# Altium schematic sheet SCH_HVKQ_Mr_THANG.SchDoc
size A2; SheetNumber: 1; SheetTotal: 1
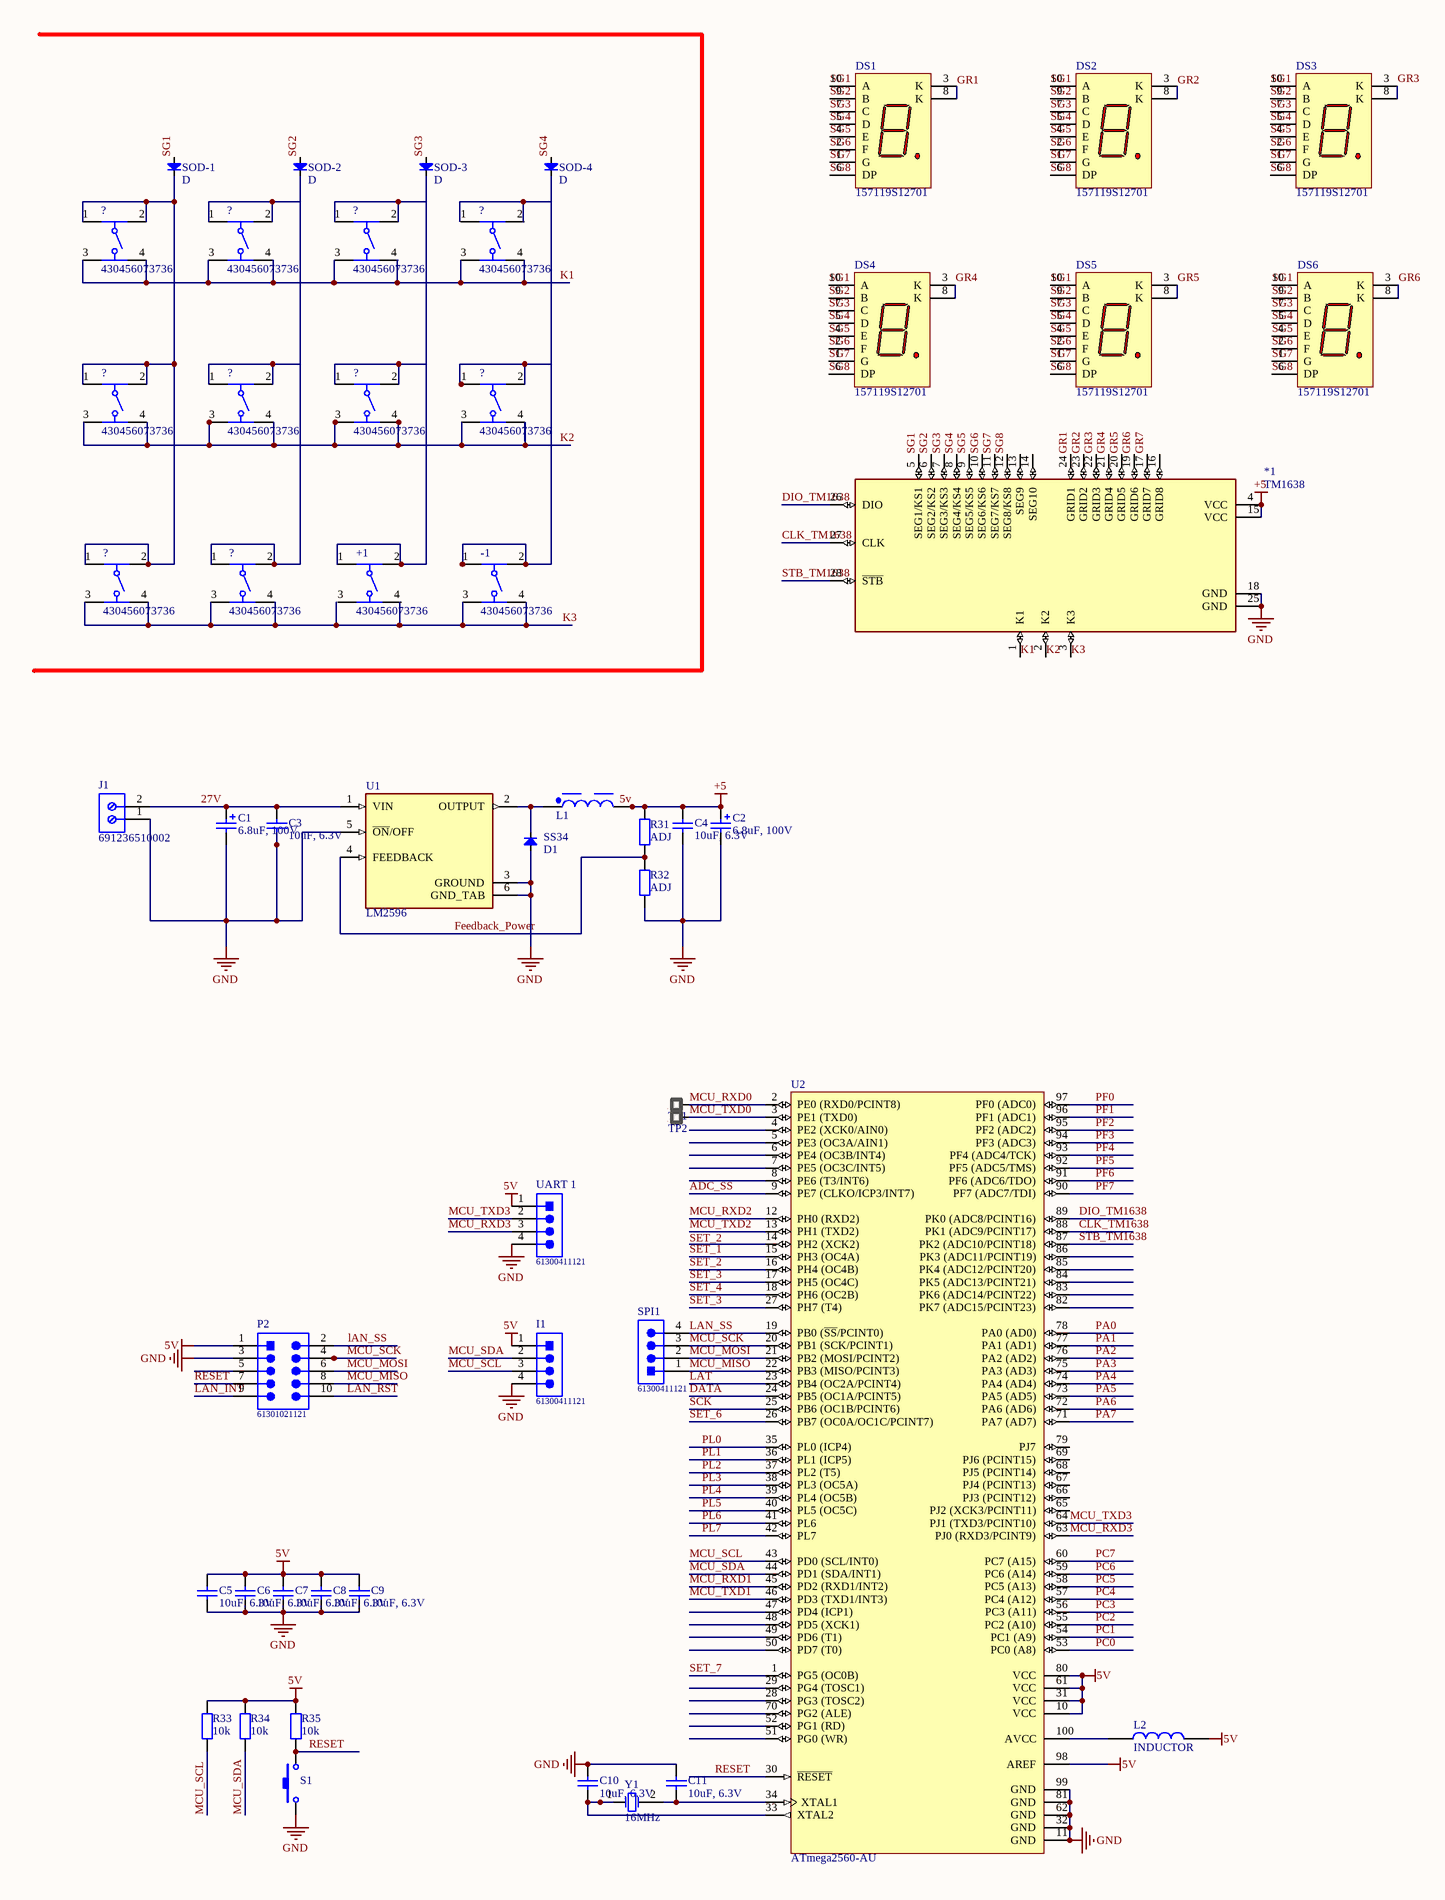
[diagram p0: SCH_HVKQ_Mr_THANG.SchDoc, left]
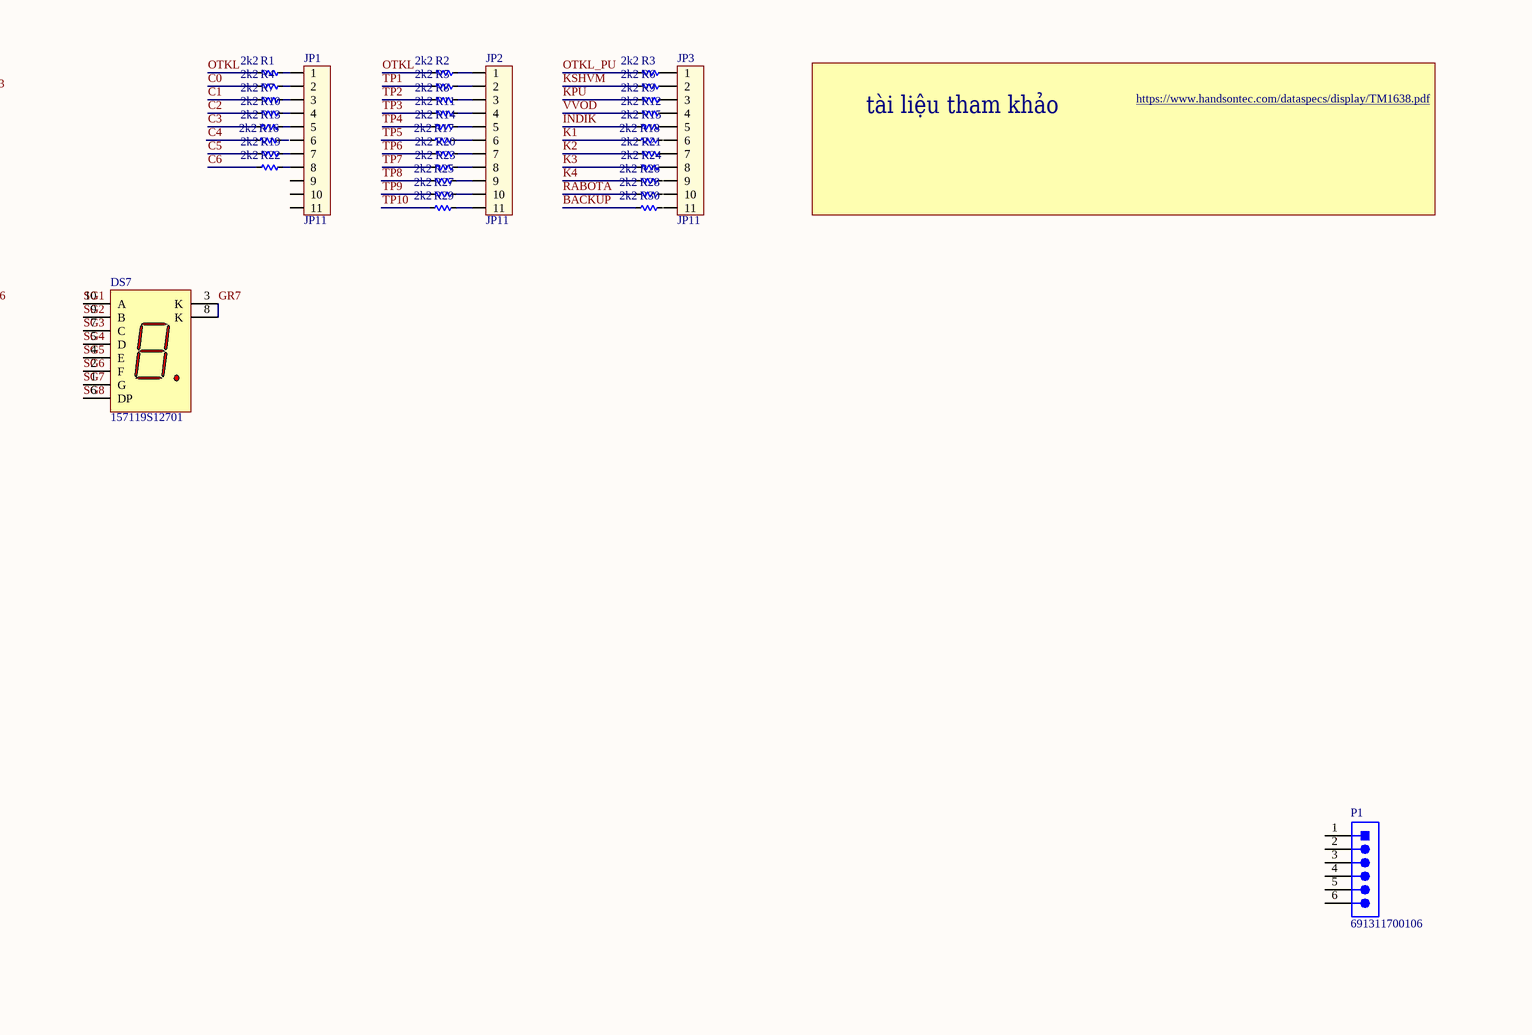
[diagram p1: SCH_HVKQ_Mr_THANG.SchDoc, right]

## Parts
(Parts that share a designator on the sheet are numbered #1, #2 ... from top to bottom, then left to right.)
*1  TM1638  [SOIC28]
+1  430456073736  [4304x60737x6]
-1  430456073736  [4304x60737x6]
?#1  430456073736  [4304x60737x6]
?#2  430456073736  [4304x60737x6]
?#3  430456073736  [4304x60737x6]
?#4  430456073736  [4304x60737x6]
?#5  430456073736  [4304x60737x6]
?#6  430456073736  [4304x60737x6]
?#7  430456073736  [4304x60737x6]
?#8  430456073736  [4304x60737x6]
?#9  430456073736  [4304x60737x6]
?#10  430456073736  [4304x60737x6]
C1  6.8uF, 100V  [WCAP-PSHP_D8H8.7]
C2  6.8uF, 100V  [WCAP-PSHP_D8H8.7]
C3  10uF, 6.3V  [WCAP-CSGP_0805_L2W1.25H1.25]
C4  10uF, 6.3V  [WCAP-CSGP_0805_L2W1.25H1.25]
C5  10uF, 6.3V  [WCAP-CSGP_0805_L2W1.25H1.25]
C6  10uF, 6.3V  [WCAP-CSGP_0805_L2W1.25H1.25]
C7  10uF, 6.3V  [WCAP-CSGP_0805_L2W1.25H1.25]
C8  10uF, 6.3V  [WCAP-CSGP_0805_L2W1.25H1.25]
C9  10uF, 6.3V  [WCAP-CSGP_0805_L2W1.25H1.25]
C10  10uF, 6.3V  [WCAP-CSGP_0805_L2W1.25H1.25]
C11  10uF, 6.3V  [WCAP-CSGP_0805_L2W1.25H1.25]
D1  SS34  [DIO-SMD-106]
DS1  157119S12701  [WL-T7DS_L13W10H7]
DS2  157119S12701  [WL-T7DS_L13W10H7]
DS3  157119S12701  [WL-T7DS_L13W10H7]
DS4  157119S12701  [WL-T7DS_L13W10H7]
DS5  157119S12701  [WL-T7DS_L13W10H7]
DS6  157119S12701  [WL-T7DS_L13W10H7]
DS7  157119S12701  [WL-T7DS_L13W10H7]
I1  61300411121  [61300411121]
J1  691236510002  [691236510002]
JP1  JP11  [Header11]
JP2  JP11  [Header11]
JP3  JP11  [Header11]
L1  470µH, 0.97A  [WE-PD HV_1210]  (value not drawn)
L2  INDUCTOR  [L_0805]
P1  691311700106  [691311700106]
P2  61301021121  [61301021121]
R1  2k2  [RES-SMD-1206]
R2  2k2  [RES-SMD-1206]
R3  2k2  [RES-SMD-1206]
R4  2k2  [RES-SMD-1206]
R5  2k2  [RES-SMD-1206]
R6  2k2  [RES-SMD-1206]
R7  2k2  [RES-SMD-1206]
R8  2k2  [RES-SMD-1206]
R9  2k2  [RES-SMD-1206]
R10  2k2  [RES-SMD-1206]
R11  2k2  [RES-SMD-1206]
R12  2k2  [RES-SMD-1206]
R13  2k2  [RES-SMD-1206]
R14  2k2  [RES-SMD-1206]
R15  2k2  [RES-SMD-1206]
R16  2k2  [RES-SMD-1206]
R17  2k2  [RES-SMD-1206]
R18  2k2  [RES-SMD-1206]
R19  2k2  [RES-SMD-1206]
R20  2k2  [RES-SMD-1206]
R21  2k2  [RES-SMD-1206]
R22  2k2  [RES-SMD-1206]
R23  2k2  [RES-SMD-1206]
R24  2k2  [RES-SMD-1206]
R25  2k2  [RES-SMD-1206]
R26  2k2  [RES-SMD-1206]
R27  2k2  [RES-SMD-1206]
R28  2k2  [RES-SMD-1206]
R29  2k2  [RES-SMD-1206]
R30  2k2  [RES-SMD-1206]
R31  ADJ  [WRIS-PSMB_0805_H0.35]
R32  ADJ  [WRIS-PSMB_0805_H0.35]
R33  10k  [WRIS-PSMB_0805_H0.35]
R34  10k  [WRIS-PSMB_0805_H0.35]
R35  10k  [WRIS-PSMB_0805_H0.35]
S1  SW-SMD  [SW-SMD]  (value not drawn)
SOD-1  D  [SOD-80]
SOD-2  D  [SOD-80]
SOD-3  D  [SOD-80]
SOD-4  D  [SOD-80]
SPI1  61300411121  [61300411121]
TP1  TP  [TP]  (value not drawn)
TP2  TP  [TP]  (value not drawn)
U1  LM2596  [LM2596]
U2  ATmega2560-AU  [TQFP100L]
UART_1  61300411121  [61300411121]
Y1  16MHz  [WE-XTAL_HC49/4HSMX]

## Nets
5v: *1.4(VCC) *1.15(VCC) C2.1(P) C4.2 C5.2 C6.2 C7.2 C8.2 C9.2 I1.1 L1.2 L2.2 P2.1 R31.2 R33.2 R34.2 R35.2 U2.10(VCC) U2.31(VCC) U2.61(VCC) U2.80(VCC) U2.98(AREF) UART_1.1  [also labelled +5]
GND: *1.18(GND) *1.25(GND) C1.2(N) C2.2(N) C3.1 C4.1 C5.1 C6.1 C7.1 C8.1 C9.1 C10.2 C11.2 D1.1(A) I1.4 J1.1 P2.3 R32.1 S1.1 U1.3(GROUND) U1.5(~{ON}/OFF) U1.6(GND_TAB) U2.11(GND) U2.32(GND) U2.62(GND) U2.81(GND) U2.99(GND) UART_1.4
27V: C1.1(P) C3.2 J1.2 U1.1(VIN)
ADC_SS: U2.9(PE7_(CLKO/ICP3/INT7))
BACKUP: R30.2
C0: R4.2
C1: R7.2
C2: R10.2
C3: R13.2
C4: R16.2
C5: R19.2
C6: R22.2
CLK_TM1638: *1.27(CLK) U2.88(PK1_(ADC9/PCINT17))
DATA: U2.24(PB5_(OC1A/PCINT5))
DIO_TM1638: *1.26(DIO) U2.89(PK0_(ADC8/PCINT16))
Feedback_Power: R31.1 R32.2 U1.4(FEEDBACK)
GR1: *1.24(GRID1) DS1.3(K) DS1.8(K)
GR2: *1.23(GRID2) DS2.3(K) DS2.8(K)
GR3: *1.22(GRID3) DS3.3(K) DS3.8(K)
GR4: *1.21(GRID4) DS4.3(K) DS4.8(K)
GR5: *1.20(GRID5) DS5.3(K) DS5.8(K)
GR6: *1.19(GRID6) DS6.3(K) DS6.8(K)
GR7: *1.17(GRID7) DS7.3(K) DS7.8(K)
INDIK: R15.2
K1: *1.1(K1) ?#1.3 ?#1.4 ?#2.3 ?#2.4 ?#3.3 ?#3.4 ?#4.3 ?#4.4 R18.2
K2: *1.2(K2) ?#5.3 ?#5.4 ?#6.3 ?#6.4 ?#7.3 ?#7.4 ?#8.3 ?#8.4 R21.2
K3: *1.3(K3) -1.3 -1.4 ?#9.3 ?#9.4 ?#10.3 ?#10.4 R24.2
K4: R26.2
KPU: R9.2
KSHVM: R6.2
LAN_INT: P2.9
LAN_RST: P2.10
LAN_SS: P2.2 SPI1.4 U2.19(PB0_(~{SS}/PCINT0))
LAT: U2.23(PB4_(OC2A/PCINT4))
MCU_MISO: P2.8 SPI1.1 U2.22(PB3_(MISO/PCINT3))
MCU_MOSI: P2.6 SPI1.2 U2.21(PB2_(MOSI/PCINT2))
MCU_RXD0: TP1.1 U2.2(PE0_(RXD0/PCINT8))
MCU_RXD1: U2.45(PD2_(RXD1/INT2))
MCU_RXD2: U2.12(PH0_(RXD2))
MCU_RXD3: U2.63(PJ0_(RXD3/PCINT9)) UART_1.3
MCU_SCK: P2.4 SPI1.3 U2.20(PB1_(SCK/PCINT1))
MCU_SCL: I1.3 R33.1 U2.43(PD0_(SCL/INT0))
MCU_SDA: I1.2 R34.1 U2.44(PD1_(SDA/INT1))
MCU_TXD0: TP2.1 U2.3(PE1_(TXD0))
MCU_TXD1: U2.46(PD3_(TXD1/INT3))
MCU_TXD2: U2.13(PH1_(TXD2))
MCU_TXD3: U2.64(PJ1_(TXD3/PCINT10)) UART_1.2
OTKL: R1.2 R2.2
OTKL_PU: R3.2
PA0: U2.78(PA0_(AD0))
PA1: U2.77(PA1_(AD1))
PA2: U2.76(PA2_(AD2))
PA3: U2.75(PA3_(AD3))
PA4: U2.74(PA4_(AD4))
PA5: U2.73(PA5_(AD5))
PA6: U2.72(PA6_(AD6))
PA7: U2.71(PA7_(AD7))
PC0: U2.53(PC0_(A8))
PC1: U2.54(PC1_(A9))
PC2: U2.55(PC2_(A10))
PC3: U2.56(PC3_(A11))
PC4: U2.57(PC4_(A12))
PC5: U2.58(PC5_(A13))
PC6: U2.59(PC6_(A14))
PC7: U2.60(PC7_(A15))
PF0: U2.97(PF0_(ADC0))
PF1: U2.96(PF1_(ADC1))
PF2: U2.95(PF2_(ADC2))
PF3: U2.94(PF3_(ADC3))
PF4: U2.93(PF4_(ADC4/TCK))
PF5: U2.92(PF5_(ADC5/TMS))
PF6: U2.91(PF6_(ADC6/TDO))
PF7: U2.90(PF7_(ADC7/TDI))
PL0: U2.35(PL0_(ICP4))
PL1: U2.36(PL1_(ICP5))
PL2: U2.37(PL2_(T5))
PL3: U2.38(PL3_(OC5A))
PL4: U2.39(PL4_(OC5B))
PL5: U2.40(PL5_(OC5C))
PL6: U2.41(PL6)
PL7: U2.42(PL7)
RABOTA: R28.2
RESET: P2.7 R35.1 S1.2 U2.30(~{RESET})
SCK: U2.25(PB6_(OC1B/PCINT6))
SET_1: U2.15(PH3_(OC4A))
SET_2: U2.16(PH4_(OC4B))
SET_3: U2.17(PH5_(OC4C)) U2.27(PH7_(T4))
SET_4: U2.18(PH6_(OC2B))
SET_6: U2.26(PB7_(OC0A/OC1C/PCINT7))
SET_7: U2.1(PG5_(OC0B))
SG1: *1.5(SEG1/KS1) DS1.10(A) DS2.10(A) DS3.10(A) DS4.10(A) DS5.10(A) DS6.10(A) DS7.10(A) SOD-1.1(A)
SG2: *1.6(SEG2/KS2) DS1.9(B) DS2.9(B) DS3.9(B) DS4.9(B) DS5.9(B) DS6.9(B) DS7.9(B) SOD-2.1(A)
SG3: *1.7(SEG3/KS3) DS1.7(C) DS2.7(C) DS3.7(C) DS4.7(C) DS5.7(C) DS6.7(C) DS7.7(C) SOD-3.1(A)
SG4: *1.8(SEG4/KS4) DS1.5(D) DS2.5(D) DS3.5(D) DS4.5(D) DS5.5(D) DS6.5(D) DS7.5(D) SOD-4.1(A)
SG5: *1.9(SEG5/KS5) DS1.4(E) DS2.4(E) DS3.4(E) DS4.4(E) DS5.4(E) DS6.4(E) DS7.4(E)
SG6: *1.10(SEG6/KS6) DS1.2(F) DS2.2(F) DS3.2(F) DS4.2(F) DS5.2(F) DS6.2(F) DS7.2(F)
SG7: *1.11(SEG7/KS7) DS1.1(G) DS2.1(G) DS3.1(G) DS4.1(G) DS5.1(G) DS6.1(G) DS7.1(G)
SG8: *1.12(SEG8/KS8) DS1.6(DP) DS2.6(DP) DS3.6(DP) DS4.6(DP) DS5.6(DP) DS6.6(DP) DS7.6(DP)
STB_TM1638: *1.28(~{STB}) U2.87(PK2_(ADC10/PCINT18))
TP1: R5.2
TP2: R8.2
TP3: R11.2
TP4: R14.2
TP5: R17.2
TP6: R20.2
TP7: R23.2
TP8: R25.2
TP9: R27.2
TP10: R29.2
VVOD: R12.2
Net+1_1: +1.1 +1.2 ?#3.1 ?#3.2 ?#7.1 ?#7.2 SOD-3.2(K)
Net-1_1: -1.1 -1.2 ?#8.1 ?#8.2 SOD-4.2(K)
Net?#1_1: ?#1.1 ?#1.2 ?#5.1 ?#5.2 ?#9.1 ?#9.2 SOD-1.2(K)
Net?#2_1: ?#2.1 ?#2.2 ?#6.1 ?#6.2 ?#10.1 ?#10.2 SOD-2.2(K)
NetC10_1: C10.1 U2.33(XTAL2) Y1.1(OSC1)
NetC11_1: C11.1 U2.34(XTAL1) Y1.2(OSC2)
NetD1_2: D1.2(K) L1.1 U1.2(OUTPUT)
NetJP1_1: JP1.1 R1.1
NetJP1_2: JP1.2 R4.1
NetJP1_3: JP1.3 R7.1
NetJP1_4: JP1.4 R10.1
NetJP1_5: JP1.5 R13.1
NetJP1_7: JP1.7 R19.1
NetJP1_8: JP1.8 R22.1
NetJP2_1: JP2.1 R2.1
NetJP2_2: JP2.2 R5.1
NetJP2_3: JP2.3 R8.1
NetJP2_4: JP2.4 R11.1
NetJP2_5: JP2.5 R14.1
NetJP2_6: JP2.6 R17.1
NetJP2_7: JP2.7 R20.1
NetJP2_8: JP2.8 R23.1
NetJP2_9: JP2.9 R25.1
NetJP2_10: JP2.10 R27.1
NetJP2_11: JP2.11 R29.1
NetJP3_1: JP3.1 R3.1
NetJP3_2: JP3.2 R6.1
NetJP3_3: JP3.3 R9.1
NetJP3_4: JP3.4 R12.1
NetJP3_5: JP3.5 R15.1
NetJP3_7: JP3.7 R21.1
NetJP3_8: JP3.8 R24.1
NetL2_1: L2.1 U2.100(AVCC)

Not connected (* = marked no-connect by the designer): *1 13(SEG9) 14(SEG10) 16(GRID8); +1 3 4; ?#4 1 2; JP1 6 9 10 11; JP3 6 9 10 11; P1 1 2 3 4 5 6; P2 5; R16 1; R18 1; R26 1; R28 1; R30 1; U2 4(PE2_(XCK0/AIN0)) 5(PE3_(OC3A/AIN1)) 6(PE4_(OC3B/INT4)) 7(PE5_(OC3C/INT5)) 8(PE6_(T3/INT6)) 14(PH2_(XCK2)) 28(PG3_(TOSC2)) 29(PG4_(TOSC1)) 47(PD4_(ICP1)) 48(PD5_(XCK1)) 49(PD6_(T1)) 50(PD7_(T0)) 51(PG0_(WR)) 52(PG1_(RD)) 65(PJ2_(XCK3/PCINT11)) 66(PJ3_(PCINT12)) 67(PJ4_(PCINT13)) 68(PJ5_(PCINT14)) 69(PJ6_(PCINT15)) 70(PG2_(ALE)) 79(PJ7) 82(PK7_(ADC15/PCINT23)) 83(PK6_(ADC14/PCINT22)) 84(PK5_(ADC13/PCINT21)) 85(PK4_(ADC12/PCINT20)) 86(PK3_(ADC11/PCINT19))

## Notes on the sheet
- tài liệu tham khảo
- https://www.handsontec.com/dataspecs/display/TM1638.pdf
- Labels drawn without touching a wire or pin: SET_2

## Library data of the parts
+1 -1 ?#1-?#10 = 430456073736: WS-TATV THT Washable Tact Switch 12x12mm, height 7.3mm, 360gf; Rated Voltage: 12VDC; Rated Current: 50mA; Washable: Yes; ComponentLink1Description: Manufacturer; ComponentLink1URL: http://www.we-online.de; ComponentLink2Description: Datasheet; ComponentLink2URL: https://katalog.we-online.com/em/datasheet/430456073736.pdf; Operating Temperature: -40 to +85degC; Part Number: 430456073736; Published Date: September 2019; Contact Material: Stainless Steel; Height: 7.3mm; Mounting Technology: THT; Contact Plating: Silver; Operation Force: 360gf; Packaging: Bulk; Terminal Material: Copper Alloy; Publisher: Wurth Elektronik; Terminal Plating: Silver
C1 C2 = 875115952001: WCAP-PSHP Aluminum Polymer Capacitor, V-Chip, SMT, D8xH8.7mm, 6.8uF, 100V; Manufacturer: Wurth Elektronik; Ripple Current: 1500mA; Technical Reference: PSEE0876R8M100DVCTEB000; Capacitance Tolerance: +/-20%; Rated Voltage: 100VDC; Dissipation Factor: 12%; Endurance: 2000h; ESR: 48mOhm; Leakage Current: 136uA; Height: 8.7mm; ComponentLink1URL: http://www.we-online.de; Operating Temperature: -55 to +105degC; Manufacturer Part Number: 875115952001; ComponentLink1Description: Manufacturer; Mounting Technology: SMT; ComponentLink2URL: https://www.we-online.com/catalog/datasheet/875115952001.pdf; Published Date: October 2020; Capacitance: 6.8uF; Packaging: Tape and Reel; ComponentLink2Description: Datasheet; Diameter: 8mm
C3-C11 = 885012107004: WCAP-CSGP Multilayer Ceramic Chip Capacitor, General Purpose, size 0805, X5R, 10uF, 6.3V; Manufacturer: Wurth Elektronik; Capacitance Tolerance: +/-20%; Dissipation Factor: 15%; Isolation Resistance: 0.01GOhm; Technical Reference: X5R0805106M6R3DFCT10000; Capacitance: 10uF; Ceramic Type: X5R; ComponentLink1Description: Manufacturer Link; ComponentLink1URL: http://www.we-online.de; ComponentLink2Description: Datasheet; ComponentLink2URL: https://www.we-online.com/catalog/datasheet/885012107004.pdf; Height: 1.25mm; Length: 2mm; Manufacturer Part Number: 885012107004; Mounting Technology: SMT; Operating Temperature max.: 85C; Operating Temperature min.: -55C; Packaging: Tape and Reel; Rated Voltage: 6.3V; Size: 0805; Width: 1.25mm
D1 = Diode SMD: Default Diode; Code - JEDEC: DO-214-AB; Value: 1N5007; Published: 8-Jun-2000; Revision: July-2002: Re-released for DXP Platform.; Publisher: Altium Limited
DS1-DS7 = 157119S12701: WL-T7DS 7 Segments Display THT Single Digit, Common Cathode, 0.39"/ 9.9mm, 38mcd, 2V, Super Red; Manufacturer: Wurth Elektronik; Circuitry: Common Cathode; Width: 10mm; Mounting Technology: THT; Display Height: 0.39"/ 9.9mm; Operating Temperature max.: 85C; Packaging: Tube; Luminous Intensity: 38mcd; Length: 13mm; ComponentLink2Description: Datasheet; Forward Voltage: 2V; ComponentLink1Description: Manufacturer Link; Manufacturer Part Number: 157119S12701; Height: 7mm; ComponentLink1URL: http://www.we-online.de; Emitting Color: Super Red; ComponentLink2URL: https://www.we-online.com/catalog/datasheet/157119S12701.pdf; Operating Temperature min.: -40C
I1 SPI1 UART_1 = 61300411121: WR-PHD Pin Header, THT, pitch 2.54mm, Single Row, Vertical, 4p; Manufacturer: Wurth Elektronik; Pin Number: 4; Rated Current: 3A; Working Voltage: 250VAC; Withstanding Voltage: 500VAC; Contact Resistance: 20mOhm; ComponentLink1Description: Manufacturer; ComponentLink1URL: http://www.we-online.de; ComponentLink2Description: Datasheet; ComponentLink2URL: https://www.we-online.com/catalog/datasheet/61300411121.pdf; Manufacturer Part Number: 61300411121; Pitch: 2.54mm; Operating Temperature: -40 to +105degC; Mounting Technology: THT; Packaging: Bag; Gender: Pin Header; Row Number: Single; Orientation: Vertical
J1 = 691236510002: WR-TBL Serie 2365 Horizontal Entry, Rising Cage Clamp, THT, pitch 5.08mm, 2p; Manufacturer: Wurth Elektronik; Modularity: Yes; PCB/Cable/Panel: PCB; Pin Number: 2; Rated Current [UL]: 20A; Working Voltage [UL]: 300VAC; ComponentLink1Description: Manufacturer; ComponentLink1URL: http://www.we-online.de; ComponentLink2URL: https://katalog.we-online.de/em/datasheet/691236510002.pdf; ComponentLink2Description: Datasheet; Mounting Technology: THT; Manufacturer Part Number: 691236510002; Packaging: Box; Operating Temperature: -30 to +120degC; Pitch: 5.08mm; Published Date: Feburary 2021; Type: Horizontal; Application: Rising Cage Clamp
JP1-JP3 = Header11: Connector 11; Value: Connector 11
L1 = 7687709471: WE-PD HV SMT High Voltage Power Inductor, size 1210, 470µH, 0.97A, 0.8Ω; Manufacturer: Wurth Elektronik; Case/Size Code: 1210; DC Resistance: 0.68Ω; Operating Voltage (DC): 400V; Saturation Current: 1.4A; Self Resonant Frequency: 1.9MHz; Manufacturer Part Number: 7687709471; Category: High Voltage Power Inductors; Match Code: WE-PD HV; ComponentLink1Description: Website Link; ComponentLink1URL: https://www.we-online.com/redexpert/article/7687709471?ad; ComponentLink2Description: Datasheet Link; ComponentLink2URL: https://www.we-online.com/redexpert/spec/7687709471?ad; Mount: Surface Mount; Operating Temperature Max: 125°C; Operating Temperature Min: -40°C; Packaging: Tape and Reel; Length: 12mm; Width: 12mm; Height: 10.5mm; DC Resistance Max: 0.8Ω; Inductance: 470µH; Rated Current: 0.97A
P1 = 691311700106: WR-TBL Serie 3117 Close Vertical PCB Header, Pluggable, THT, pitch 5mm, 6p; Manufacturer: Wurth Elektronik; Modularity: No; Pin Number: 6; Rated Current [UL]: 20A; Working Voltage [UL]: 300VAC; ComponentLink1Description: Manufacturer; ComponentLink1URL: http://www.we-online.de; ComponentLink2URL: https://katalog.we-online.de/em/datasheet/691311700106.pdf; ComponentLink2Description: Datasheet; Mounting Technology: THT; Manufacturer Part Number: 691311700106; Packaging: Box; Operating Temperature: -40 to +105degC; PCB/Cable/Panel: PCB; Pitch: 5mm; Published Date: Feburary 2021; Type: Vertical; Application: Pluggable
P2 = 61301021121: WR-PHD Pin Header, THT, pitch 2.54mm, Dual Row, Vertical, 10p; Manufacturer: Wurth Elektronik; Pin Number: 10; Rated Current: 3A; Working Voltage: 250VAC; Withstanding Voltage: 500VAC; Contact Resistance: 20mOhm; ComponentLink1Description: Manufacturer; ComponentLink1URL: http://www.we-online.de; ComponentLink2Description: Datasheet; ComponentLink2URL: https://www.we-online.com/catalog/datasheet/61301021121.pdf; Manufacturer Part Number: 61301021121; Pitch: 2.54mm; Operating Temperature: -40 to +105degC; Mounting Technology: THT; Packaging: Bag; Gender: Pin Header; Row Number: Dual; Orientation: Vertical
R1-R30 = Res-SMD: Resistor; Manufacturer: Generic Components; Class: Passive; Published: 08/06/2000; Publisher: Altium Hobart Technology Centre
R31-R35 = 580060720003: WRIS-PSMB SMT Metal Plate Resistor, size 0805, 5mOhm, 0.5W; Manufacturer: Wurth Elektronik; Rated Current: 10A; Temperature Coefficient of Resistance: +/-100ppm/degC; Technical Reference: MB0805R005F102KAATP0000; Resistance Tolerance: +/-1%; ComponentLink1Description: Manufacturer; ComponentLink1URL: http://www.we-online.de; ComponentLink2Description: Datasheet; ComponentLink2URL: https://www.we-online.com/catalog/datasheet/580060720003.pdf; Rated Power: 0.5W; Resistance: 5mOhm; Mounting Technology: SMT; Height: 0.35mm; Manufacturer Part Number: 580060720003; Packaging: Tape and Reel; Published Date: May 2020; Size: 0805; Length: 2mm; Operating Temperature: -55 to +155degC; Width: 1.25mm
S1 = SW-SMD: Switch; Published: 24-Mar-1999; LatestRevisionDate: 17-Jul-2002; LatestRevisionNote: Re-released for DXP Platform.; PackageReference: SPST-2; Publisher: Altium Limited
SOD-1-SOD-4 = 1N4148
TP1 TP2 = TEST POINT
U2 = ATmega2560-AU: 8-bit AVR Microcontroller, 4.5-5.5V, 256KB Flash, 4KB EEPROM, 8KB SRAM, 86 GPIO pins, 100-pin TQFP, Industrial Grade (-40°C to 85°C), Pb-Free; Supplier 1: Digi-Key; Supplier Part Number 1: ATMEGA2560-16AUR-ND
Y1 = 830003237: WE-XTAL Quartz Crystal, SMT, HC49/4HSMX, 16MHz, +/-30ppm; Manufacturer: Wurth Elektronik; Frequency Stability: +/-50ppm; Load Capacitance: 16pF; ComponentLink1Description: Manufacturer; ComponentLink1URL: http://www.we-online.de; ComponentLink2Description: Datasheet; ComponentLink2URL: https://katalog.we-online.com/pbs/datasheet/830003237.pdf; Operating Temperature: -10 to +60degC; Packaging: Tape and Reel; Manufacturer Part Number: 830003237; Published Date: July 2020; Size: HC49/4HSMX; Frequency: 16MHz; Frequency Tolerance: +/-30ppm; Mounting Technology: SMT